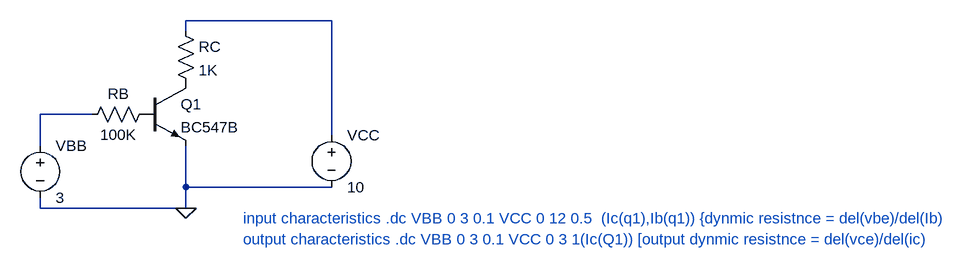
[diagram p0: schematic BJT_input_output.asc]
BJT_input_output.asc, the LTspice schematic file:
Version 4
SHEET 1 1468 680
WIRE 400 32 176 32
WIRE 176 48 176 32
WIRE 32 176 -48 176
WIRE 400 208 400 32
WIRE -48 224 -48 176
WIRE 176 288 176 224
WIRE 400 288 176 288
WIRE -48 320 -48 304
WIRE 176 320 176 288
WIRE 176 320 -48 320
FLAG 176 320 0
SYMBOL npn 112 128 R0
SYMATTR InstName Q1
SYMATTR Value BC547B
SYMBOL res 128 160 R90
WINDOW 0 0 56 VBottom 2
WINDOW 3 32 56 VTop 2
SYMATTR InstName RB
SYMATTR Value 100K
SYMBOL res 160 32 R0
SYMATTR InstName RC
SYMATTR Value 1K
SYMBOL voltage 400 192 R0
WINDOW 123 0 0 Left 0
WINDOW 39 0 0 Left 0
SYMATTR InstName VCC
SYMATTR Value 10
SYMBOL voltage -48 208 R0
SYMATTR InstName VBB
SYMATTR Value 3
TEXT 264 336 Left 2 ;input characteristics .dc VBB 0 3 0.1 VCC 0 12 0.5  (Ic(q1),Ib(q1)) {dynmic resistnce = del(vbe)/del(Ib)
TEXT 264 368 Left 2 ;output characteristics .dc VBB 0 3 0.1 VCC 0 3 1(Ic(Q1)) [output dynmic resistnce = del(vce)/del(ic)

The netlist it stands for:
* BJT_input_output.asc
Q1 P001 P002 0 0 BC547B
RB P002 N002 100K
RC N001 P001 1K
VCC N001 0 10
VBB N002 0 3
.model NPN NPN
.model PNP PNP
.lib standard.bjt
* input characteristics .dc VBB 0 3 0.1 VCC 0 12 0.5  (Ic(q1),Ib(q1)) {dynmic resistnce = del(vbe)/del(Ib)
* output characteristics .dc VBB 0 3 0.1 VCC 0 3 1(Ic(Q1)) [output dynmic resistnce = del(vce)/del(ic)
.backanno
.end